# EAGLE schematic Activities (EAGLE 7.4.0)
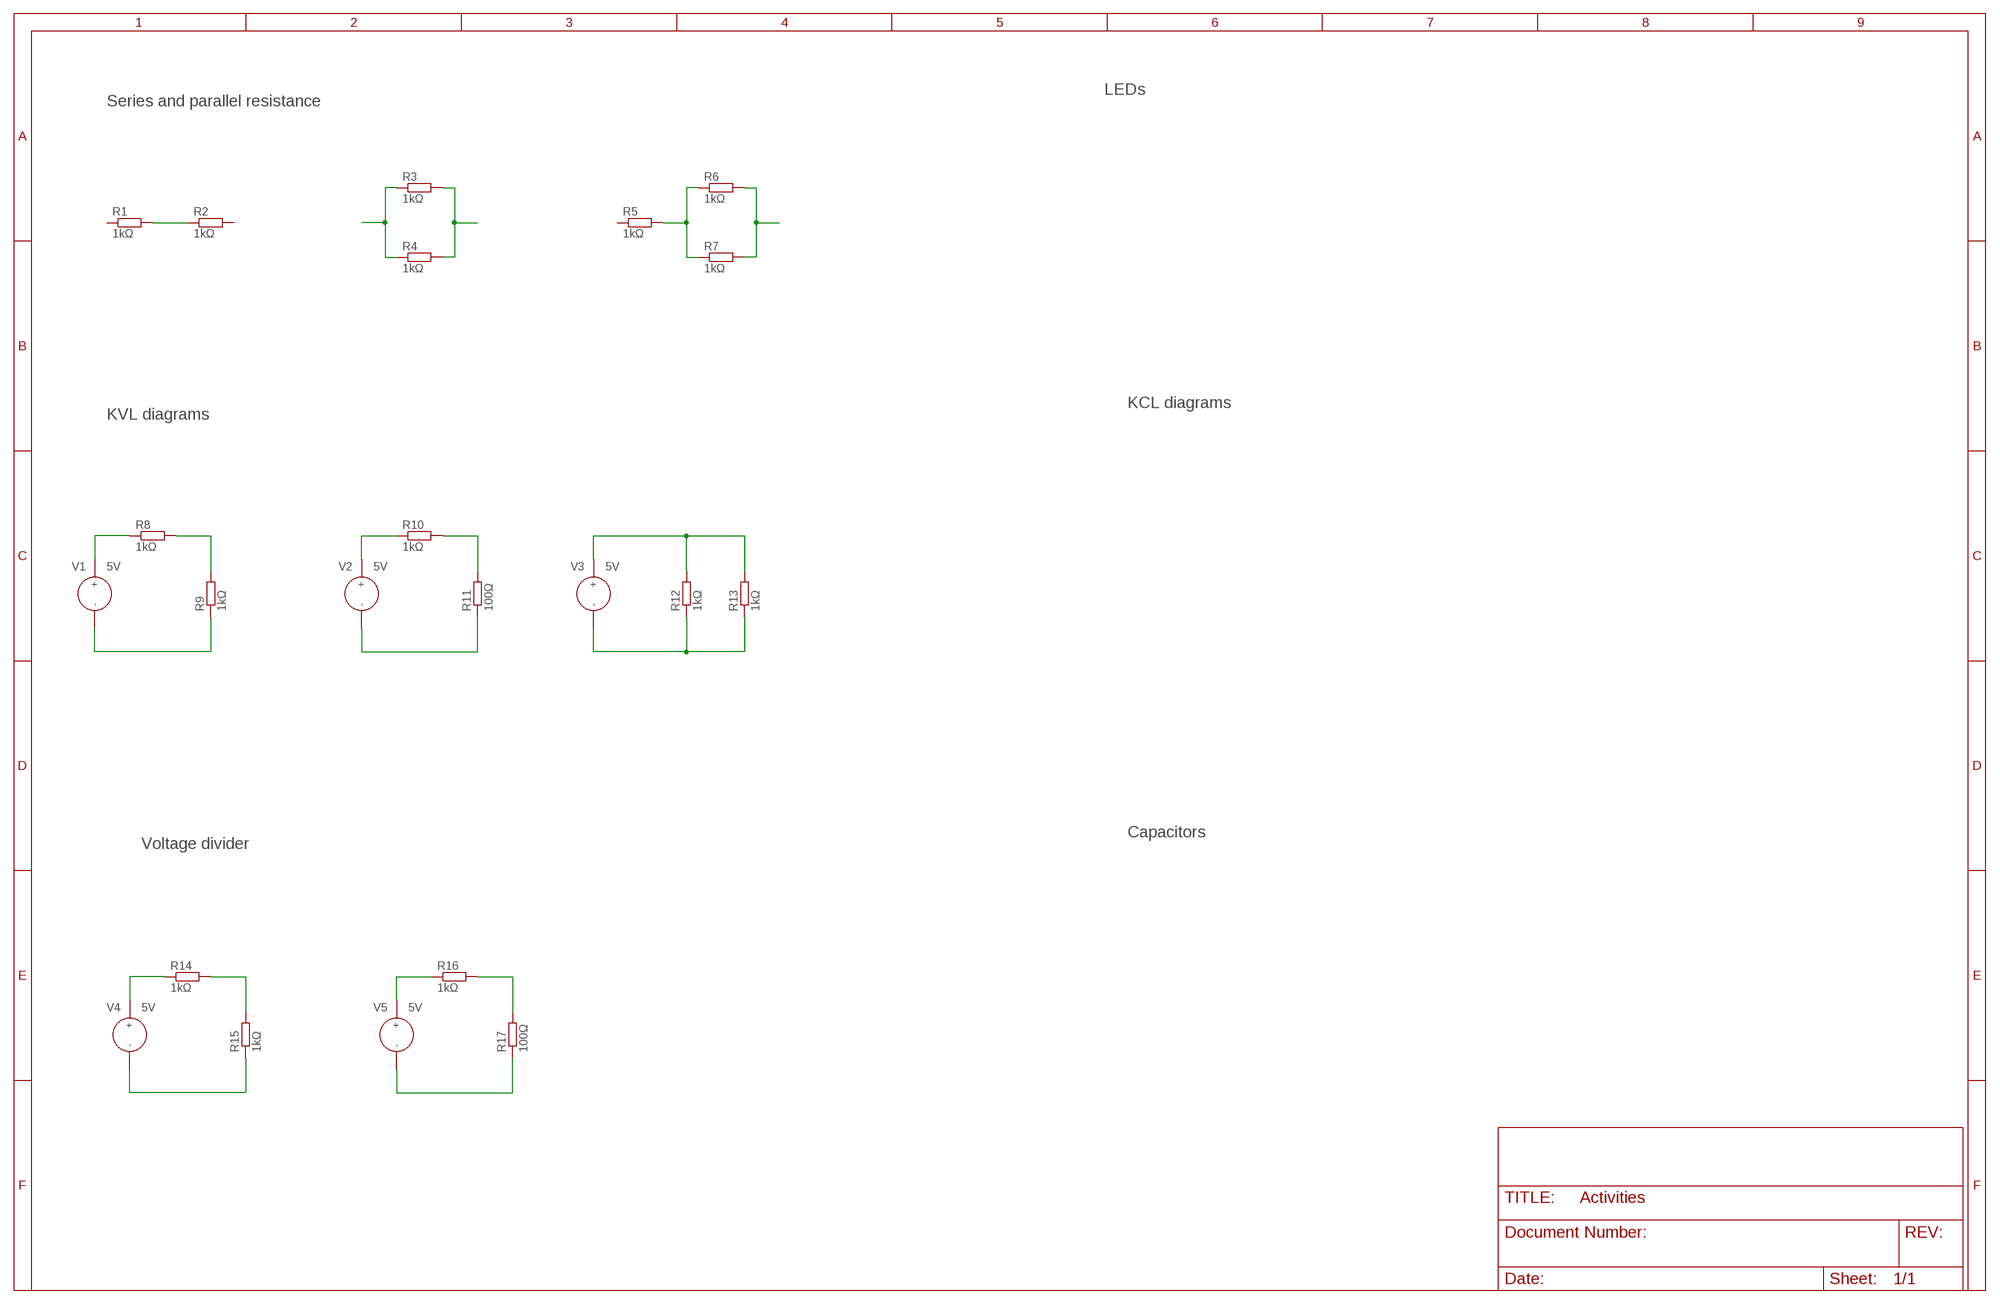
[diagram p0: schematic, sheet 1]

## Parts
R1  1kΩ  R-EU_0207/10  [0207/10]
R2  1kΩ  R-EU_0207/10  [0207/10]
R3  1kΩ  R-EU_0207/10  [0207/10]
R4  1kΩ  R-EU_0207/10  [0207/10]
R5  1kΩ  R-EU_0207/10  [0207/10]
R6  1kΩ  R-EU_0207/10  [0207/10]
R7  1kΩ  R-EU_0207/10  [0207/10]
R8  1kΩ  R-EU_0207/10  [0207/10]
R9  1kΩ  R-EU_0207/10  [0207/10]
R10  1kΩ  R-EU_0207/10  [0207/10]
R11  100Ω  R-EU_0207/10  [0207/10]
R12  1kΩ  R-EU_0207/10  [0207/10]
R13  1kΩ  R-EU_0207/10  [0207/10]
R14  1kΩ  R-EU_0207/10  [0207/10]
R15  1kΩ  R-EU_0207/10  [0207/10]
R16  1kΩ  R-EU_0207/10  [0207/10]
R17  100Ω  R-EU_0207/10  [0207/10]
V1  5V  VOLTAGE_SOURCE  [VOLTAGE_SOURCE]
V2  5V  VOLTAGE_SOURCE  [VOLTAGE_SOURCE]
V3  5V  VOLTAGE_SOURCE  [VOLTAGE_SOURCE]
V4  5V  VOLTAGE_SOURCE  [VOLTAGE_SOURCE]
V5  5V  VOLTAGE_SOURCE  [VOLTAGE_SOURCE]

## Nets
N$1: R1.2 R2.1
N$2: R3.1 R4.1
N$3: R3.2 R4.2
N$4: R5.2 R6.1 R7.1
N$5: R6.2 R7.2
N$6: R8.1 V1.1(+)
N$7: R8.2 R9.2
N$8: R9.1 V1.2(-)
N$9: R11.1 V2.2(-)
N$10: R10.2 R11.2
N$11: R10.1 V2.1(+)
N$12: R12.2 R13.2 V3.1(+)
N$13: R12.1 R13.1 V3.2(-)
N$14: R14.1 V4.1(+)
N$15: R14.2 R15.2
N$16: R15.1 V4.2(-)
N$17: R17.1 V5.2(-)
N$18: R16.2 R17.2
N$19: R16.1 V5.1(+)
Unconnected: R1.1 R2.2 R5.1

## Notes on the sheet
- LEDs
- Series and parallel resistance
- KCL diagrams
- KVL diagrams
- Capacitors
- Voltage divider

## Library data of the parts
R1-R17 = rcl:R-EU_: RESISTOR, European symbol
V1-V5 = personal:VOLTAGE_SOURCE